# Altium schematic sheet LCD Display.SchDoc
size 127 x 101 mm; PageSetup: Record=PageOptions|CenterHorizontal=True|CenterVertical=True|PrintScale=0.75|XCorrection=1.00|YCorrection=1.00|PrintKind=2|BorderSize=5000000|LeftOffset=0|BottomOffset=0|Orientation=2|PaperLength=1000|PaperWidth=1000|Scale=100|PaperSource=7|PrintQuality=-3|MediaType=1|DitherType=10|PrintScaleMode=1|PaperKind=A4|PaperIndex=9
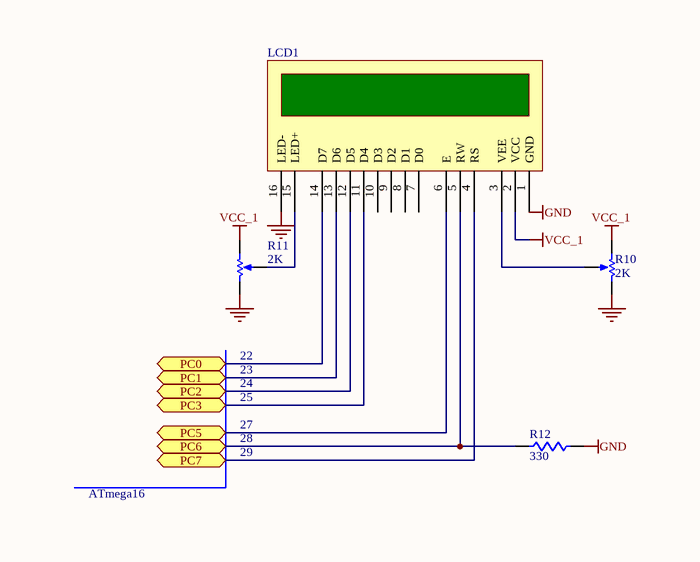
[diagram p0: LCD Display.SchDoc]

## Parts
LCD1  LCD_16*2  [LCD_2x16]  (value not drawn)
R10  value 2K  [VR8-5/5.6MM]  (hidden comment: RPot1)
R11  value 2K  [VR8-5/5.6MM]  (hidden comment: RPot1)
R12  value 330  [AXIAL0.4]  (hidden comment: Resistor)

## Ports
PC0, PC1, PC2, PC3, PC5, PC6, PC7

## Nets
GND: LCD1.1(GND) LCD1.16(LED-) R10.1(TOP) R11.2(BOT) R12.1
VCC_1: LCD1.2(VCC) R10.2(BOT) R11.1(TOP)
PC0: LCD1.14(D7) ; port PC0
PC1: LCD1.13(D6) ; port PC1
PC2: LCD1.12(D5) ; port PC2
PC3: LCD1.11(D4) ; port PC3
PC5: LCD1.6(E) ; port PC5
PC6: LCD1.5(RW) R12.2 ; port PC6
PC7: LCD1.4(RS) ; port PC7
NetLCD1_3: LCD1.3(VEE) R10.3(TAP)
NetLCD1_15: LCD1.15(LED+) R11.3(TAP)

Not connected (* = marked no-connect by the designer): LCD1 7(D0) 8(D1) 9(D2) 10(D3)

## Notes on the sheet
- 22
- 23
- 24
- 25
- 27
- 28
- ATmega16
- 29

## Library data of the parts
R10 R11 = RPot1: Potentiometer; Manufacturer: Generic Components; Class I: Passive; Set Position: 0.5; Published: 8-Jun-2000; Revision: July-2002: Re-released for DXP Platform.; Publisher: Altium Limited; Class II: Potentiometer
R12 = Resistor: Manufacturer: Generic Components; Revision: July-2002: Re-released for DXP Platform.; Publisher: Altium Limited